# Altium schematic sheet Battery_power.SchDoc
size A; SheetNumber: 3; SheetTotal: 4
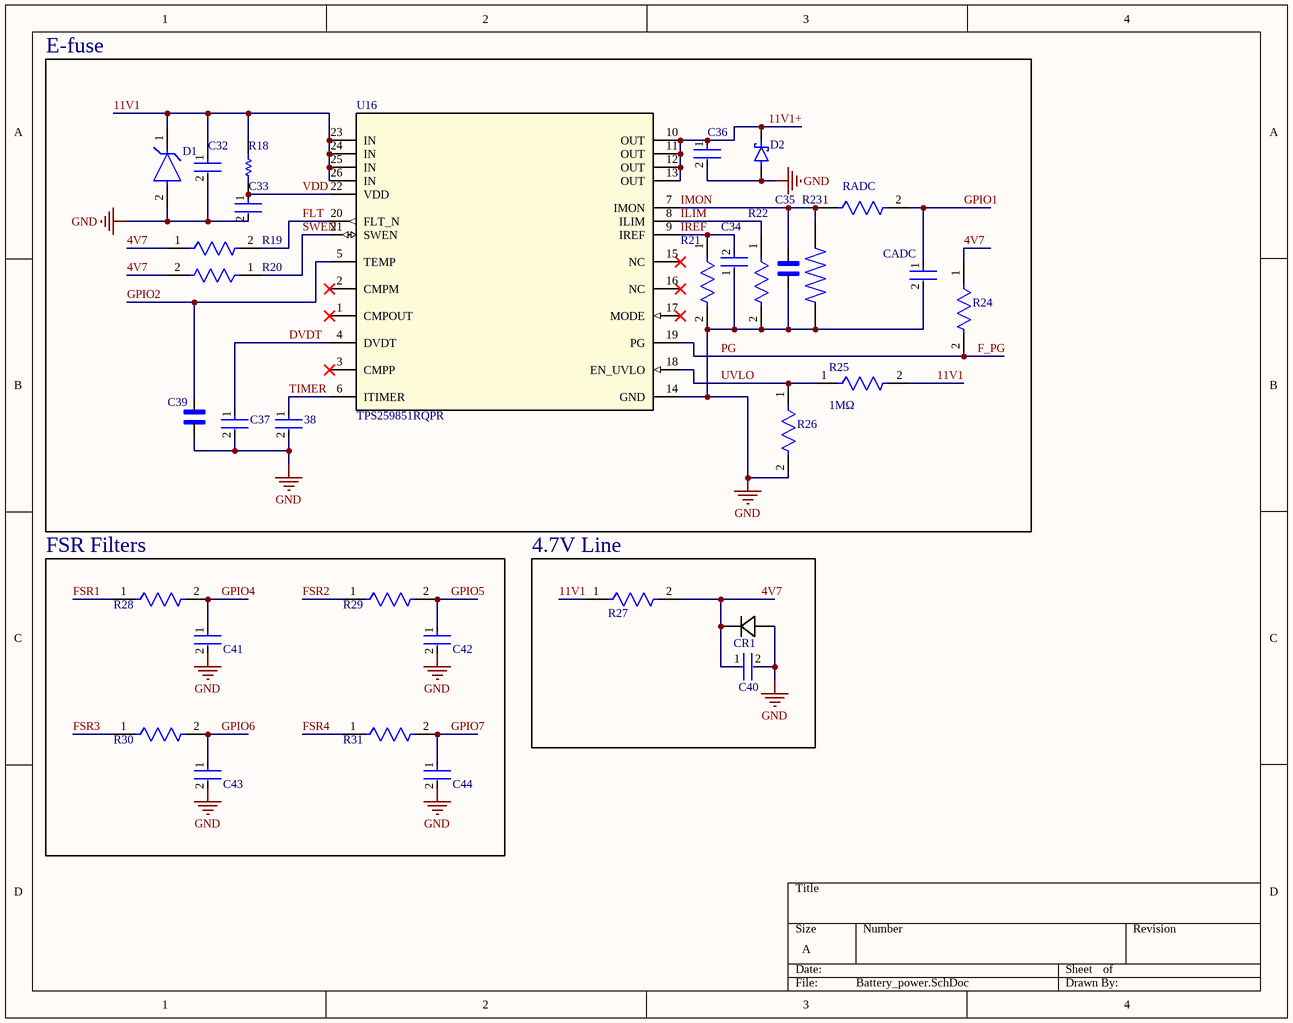
[diagram p0: Battery_power.SchDoc]

## Parts
38  GRM155R71H104KE14D  [FP-GRM155-0_05-IPC_B]  (value not drawn)
C32  CC0805KRX7R9BB104  [FP-CC0805-0_85-MFG]  (value not drawn)
C33  CC0805KKX7R9BB225  [FP-CC0805-0_85-MFG]  (value not drawn)
C34  C1608C0G1E472J080AA  [FP-C1608-080-0_1-IPC_A]  (value not drawn)
C35  GRM1885C1H101JA01D  [CAPC1608X90N]  (value not drawn)
C36  CC0805KKX7R9BB225  [FP-CC0805-0_85-MFG]  (value not drawn)
C37  GRM155R71H104KE14D  [FP-GRM155-0_05-IPC_B]  (value not drawn)
C39  GRM1885C1H101JA01D  [CAPC1608X90N]  (value not drawn)
C40  GRM155R71H104KE14D  [FP-GRM155-0_05-IPC_B]  (value not drawn)
C41  GRM155R71H104KE14D  [FP-GRM155-0_05-IPC_B]  (value not drawn)
C42  GRM155R71H104KE14D  [FP-GRM155-0_05-IPC_B]  (value not drawn)
C43  GRM155R71H104KE14D  [FP-GRM155-0_05-IPC_B]  (value not drawn)
C44  GRM155R71H104KE14D  [FP-GRM155-0_05-IPC_B]  (value not drawn)
CADC  CGA4C2C0G1H822J060AA  [FP-CGA4J-IPC_A]  (value not drawn)
CR1  BZT52C4V7-7-F  [SOD123_DIO]  (value not drawn)
D1  SMBJ12A  [FP-SMBJ-MFG]  (value not drawn)
D2  PDS1040-13  [DIO_PDS1040-13]  (value not drawn)
R18  CRCW040210R0FKED  [RESC1005X40X25NL05T05]  (value not drawn)
R19  CRCW040210K0FKEDC  [FP-CRCW0402-C-e3-IPC_C]  (value not drawn)
R20  CRCW0402100KFKED  [FP-CRCW0402-e3-IPC_C]  (value not drawn)
R21  RT0402BRD0748K7L  [FP-RT0402-MFG]  (value not drawn)
R22  RC0402FR-07499RL  [FP-RC0402-0_4-IPC_A]  (value not drawn)
R23  ERA3AEB102V  [RES_ERA3AEB102V]  (value not drawn)
R24  CRCW040210K0FKEDC  [FP-CRCW0402-C-e3-IPC_C]  (value not drawn)
R25  CRCW04021M00FKED  [CRCW0402-e3_MFG]  (value not drawn)
R26  CRCW0402121KFKED  [FP-CRCW0402-e3-MFG]  (value not drawn)
R27  RC0603FR-0710KL  [FP-RC0603-0_55-IPC_C]  (value not drawn)
R28  CRCW08054K70FKEA  [FP-CRCW0805-e3-IPC_B]  (value not drawn)
R29  CRCW08054K70FKEA  [FP-CRCW0805-e3-IPC_B]  (value not drawn)
R30  CRCW08054K70FKEA  [FP-CRCW0805-e3-IPC_B]  (value not drawn)
R31  CRCW08054K70FKEA  [FP-CRCW0805-e3-IPC_B]  (value not drawn)
RADC  CRCW08054K70FKEA  [FP-CRCW0805-e3-IPC_B]  (value not drawn)
U16  TPS259851RQPR  [RQP0026A-MFG]

## Blocks framed on the sheet
E-fuse: 38 C32-C37 C39 CADC D1 D2 R18-R26 RADC U16
FSR Filters: C41-C44 R28-R31
4.7V Line: C40 CR1 R27

## Nets
GND: 38.2 C32.2 C33.2 C34.1 C35.1 C36.2 C37.2 C39.1 C40.2 C41.2 C42.2 C43.2 C44.2 CADC.2 CR1.2 D1.2(A) D2.1(A) D2.2(A__1) R21.2 R22.2 R23.1 R26.2 U16.14(GND)
4V7: C40.1 CR1.1 R19.1 R20.2 R24.1 R27.2
11V1: C32.1 D1.1(C) R18.1 R25.2 R27.1 U16.23(IN) U16.24(IN) U16.25(IN) U16.26(IN)
11V1+: C36.1 D2.3(K) U16.10(OUT) U16.11(OUT) U16.12(OUT) U16.13(OUT)
DVDT: C37.1 U16.4(DVDT)
F_PG: R24.2 U16.19(PG)  [also labelled PG]
FLT: R19.2 U16.20(FLT_N)
FSR1: R28.1
FSR2: R29.1
FSR3: R30.1
FSR4: R31.1
GPIO1: CADC.1 RADC.2
GPIO2: C39.2 U16.5(TEMP)
GPIO4: C41.1 R28.2
GPIO5: C42.1 R29.2
GPIO6: C43.1 R30.2
GPIO7: C44.1 R31.2
ILIM: R22.1 U16.8(ILIM)
IMON: C35.2 R23.2 RADC.1 U16.7(IMON)
IREF: C34.2 R21.1 U16.9(IREF)
SWEN: R20.1 U16.21(SWEN)
TIMER: 38.1 U16.6(ITIMER)
UVLO: R25.1 R26.1 U16.18(EN_UVLO)
VDD: C33.1 R18.2 U16.22(VDD)

Not connected (* = marked no-connect by the designer): U16 1(CMPOUT)* 2(CMPM)* 3(CMPP)* 15(NC)* 16(NC)* 17(MODE)*

## Library data of the parts
38 C37 C40-C44 = CMP-2008-04639-2: Chip Multilayer Ceramic Capacitors for General Purpose, 0402, 0.10uF, X7R, 15%, 10%, 50V; Dissipation Factor: 0.025%; Capacitance: 100nF; Weight: 0.000212oz; Thickness: 0.022inch; Voltage Rating (DC): 50V; Dielectric Material: Ceramic; Termination: SMD/SMT; Case/Package: 0402; Case Code (Imperial): 0402; Mount: Surface Mount; REACH SVHC: No SVHC; Resistor Type: Ceramic; Dielectric: X7R; Max Operating Temperature: 125°C; Voltage: 50V; Lead Free: Lead Free; Package Quantity: 10000; Packaging: Tape and Reel; Length: 1mm; Material: Ceramic; Height: 0.5mm; Depth: 0.5mm; Width: 0.5mm; Min Operating Temperature: -55°C; Tolerance: 10%; Case Code (Metric): 1005; Voltage Rating: 50V
C32 = CMP-2100-03606-3: CAP CER 0.1UF 50V X7R 0805; Manufacturer: Yageo; Tolerance: 0.1; Capacitance: 100 nF; Value: 100 nF; Material: Ceramic; Device Class L1: Passive Components; ComponentLink2Description: Datasheet; Package: CC0805-0.85; Manufacturer Part Number: CC0805KRX7R9BB104; Digikey Description: CAP CER 0.1UF 50V X7R 0805; Device Class L3: Ceramic Capacitors; Temperature: -30°C to +85°C; Temperature Characteristic: X7R; Voltage Rating: 50 V; Height: 0.95mm; RoHS: TRUE; Ipc Land Pattern Name: CAPC200125X85; Device Class L2: Capacitors; Category: Cap; Temperature Range Low: -30°C; Temperature Range High: +85°C; Mouser Description: Multilayer Ceramic Capacitors MLCC - SMD/SMT 100nF 50V X7R 10%; Footprint Url: http://www.yageo.com/exep/pages/download/literatures/UPY-C_GEN_24.pdf; Automotive: No; Octopart: https://octopart.com/cc0805krx7r9bb104-yageo-192993; Lead Free: Yes; ComponentLink2URL: http://www.yageo.com/documents/recent/UPY-GPHC_Y5V_6.3V-to-50V_8.pdf
C33 C36 = CMP-03422-001390-1: CAP CER 2.2UF 50V X7R 0805; Manufacturer: Yageo; Tolerance: 0.1; Material: Ceramic; ComponentLink2Description: Datasheet; ComponentLink2URL: http://www.yageo.com/documents/recent/UPY-GPHC_Y5V_6.3V-to-50V_8.pdf; Voltage Rating: 50 V; Device Class L2: Capacitors; Footprint Url: http://www.yageo.com/exep/pages/download/literatures/UPY-C_GEN_24.pdf; Device Class L3: Ceramic Capacitors; Temperature Range High: +85°C; Category: Cap; Lead Free: Yes; Height: 0.95mm; Automotive: No; Value: 2.2 uF; Temperature Range Low: -30°C; Octopart: https://octopart.com/cc0805kkx7r9bb225-yageo-51849248; Temperature Characteristic: X7R; Ipc Land Pattern Name: CAPC200125X85; Mouser Description: 0805 50 V 2.2 uF ±10% Tolerance X7R Multilayer Ceramic Capacitor; RoHS: TRUE; Temperature: -30°C to +85°C; Capacitance: 2.2 uF; Package: CC0805-0.85; Digikey Description: CAP CER 2.2UF 50V X7R 0805; Manufacturer Part Number: CC0805KKX7R9BB225; Device Class L1: Passive Components
C34 = CMP-08246-004785-1: Multilayer Ceramic Capacitors 4.7nF ±5% 25V C0G SMD 0603; Dielectric Material: Ceramic; RoHS Compliant: Yes; Tolerance: 5%; Thickness: 0.037inch; Voltage Rating: 25V; Number of Pins: 2; Series: C; Max Operating Temperature: 125°C; Lead Free: Lead Free; Case Code (Metric): 1608; Construction: Flat; Case/Package: 0603; Min Operating Temperature: -55°C; Mount: Surface Mount; Voltage Rating (DC): 25V; Depth: 0.8mm; Case Code (Imperial): 0603; Width: 0.031inch; Radiation Hardening: No; Package Quantity: 1; Weight: 7.1E-05oz; Length: 1.6mm; Packaging: Tape and Reel; Height: 0.8mm; Dielectric: C0G; Capacitance: 4.7nF; Termination: SMD/SMT
C35 C39 = CMP-001-00083-1: SMD Capacitor C0G(EIA) with Capacitance: 100pF Tol. 5%. Rated Voltage: 50Vdc; MF: Murata Electronics; Source: GRM1885C1H101JA01D.SchLib; MP: GRM1885C1H101JA01D; Value: 100pF; Component Type: Standard; Pins: 2; Case/Package: 1608 Murata; Design Item ID: GRM1885C1H101JA01D; SnapEDA_Link: https://www.snapeda.com/parts/GRM1885C1H101JA01D/Murata+Electronics+North+America/view-part/?ref=snap; Check_prices: https://www.snapeda.com/parts/GRM1885C1H101JA01D/Murata+Electronics+North+America/view-part/?ref=eda
CADC = CMP-08246-000542-1: Cap Ceramic 8.2nF 50V C0G 5% Pad SMD 0805 +125°C Automotive T/R; Capacitance: 8.2nF; Case/Package: 0805; Package Quantity: 1; Weight: 0.000194oz; Voltage Rating (DC): 50V; Composition: Ceramic; Min Operating Temperature: -55°C; Case Code (Metric): 2012; Length: 2mm; Packaging: Tape and Reel; Height: 0.6mm; REACH SVHC: No SVHC; Case Code (Imperial): 0805; Mount: Surface Mount; Voltage Rating: 50V; Dielectric: C0G; Max Operating Temperature: 125°C; Width: 0.049inch; Depth: 1.25mm; Tolerance: 5%; Termination: SMD/SMT; Thickness: 0.028inch; Ratings: AEC-Q200
CR1 = BZT52C4V7-7-F: No Description Available; Manufacturer_Name: Diodes Inc; Copyright: Copyright (C) 2026 Ultra Librarian. All rights reserved.; Manufacturer_Part_Number: BZT52C4V7-7-F
D1 = CMP-2000-07093-2: TVS DIODE 12V 19.9V DO214AA; Manufacturer: Littelfuse; Breakdown Voltage: 13.3V; Peak Pulse Current: 30.2A; Max Junction Temp: +150°C; Peak Pulse Power: 600W; Direction: Unidirectional; Number Of Channels: 1; Lead Free: Yes; Reverse Standoff Voltage: 12V; ComponentLink2URL: https://www.littelfuse.com/~/media/electronics/datasheets/tvs_diodes/littelfuse_tvs_diode_smbj_datasheet.pdf.pdf; RoHS: TRUE; Clamping Voltage: 19.9V; Octopart: https://octopart.com/smbj12a-littelfuse-28708; Automotive: No; Manufacturer Part Number: SMBJ12A; Package: SMBJ; Mouser Description: Diode; 30.2 A (Max.); 13.30 V (Min.) @ 1 mA; 5 uA (Max.) @ 12 V; 100 A (Max.); Temperature Range High: +150°C; Device Class L1: Circuit Protection; Category: Diode; Height: 2.61mm; ComponentLink2Description: Datasheet; Digikey Description: TVS DIODE 12V 19.9V DO214AA; Device Class L3: unset; Temperature Range Low: -65°C; Temperature: -65°C to +150°C; Device Class L2: TVS Diodes
D2 = CMP-004-00032-1: Diode Schottky 40V 10A 3Pin PowerDI 5; MF: Diodes Inc.; Design Item ID: PDS1040-13; Case/Package: PowerDIâ„¢-5 Diodes Inc.; Pins: 3; Component Type: Standard; MP: PDS1040-13; Check_prices: https://www.snapeda.com/parts/PDS1040-13/Diodes+Inc./view-part/?ref=eda; Value: *; SnapEDA_Link: https://www.snapeda.com/parts/PDS1040-13/Diodes+Inc./view-part/?ref=snap; Source: PDS1040-13.SchLib
R18 = CMP-2002-08143-1: Manufacturer: Vishay Dale; Part Number: CRCW040210R0FKED
R19 R24 = CMP-02407-012085-1: RES 10K OHM 1% 1/16W 0402; Temperature Coefficient: 100ppm/°C; Power Rating: 62.5mW; Resistance: 10kR; Lead Free: Lead Free; Max Operating Temperature: 155°C; RoHS Compliant: Yes; Mount: Surface Mount; Min Operating Temperature: -55°C; Termination: Wraparound; Length: 1mm; Resistor Type: Thick Film; Contact Plating: Tin; Tolerance: 1%; Case/Package: Molded
R20 = CMP-2002-08123-3: RES Thick Film, 100kΩ, 1%, 0.063W, 100ppm/°C, 0402; Power Rating: 63mW; Resistance: 100kR; Voltage Rating (DC): 50V; Lead Free: Lead Free; Height: 0.35mm; Contact Plating: Tin; Min Operating Temperature: -55°C; Package Quantity: 10000; Case/Package: 0402; Temperature Coefficient: 100ppm/°C; Number of Terminations: 2; Packaging: Tape and Reel; Max Power Dissipation: 63mW; Case Code (Metric): 1005; Mount: Surface Mount; Width: 0.02inch; Termination: SMD/SMT; Length: 1mm; Number of Pins: 2; Weight: 2.3E-05oz; Radiation Hardening: No; Tolerance: 1%; Military Standard: Not; Features: Automotive AEC-Q200; Depth: 0.5mm; Composition: Thick Film; Max Operating Temperature: 155°C; Voltage Rating: 50V; Case Code (Imperial): 0402
R21 = CMP-2002-02883-2: RES SMD 48.7K OHM 0.1% 1/16W; Manufacturer: Yageo; Value: 48.7KΩ; Power Rating: 0.063W; Voltage Rating: 50V; Tolerance: 0.001; Temperature Coefficient: 25 ppm/°C; Package: RT0402; Temperature Range Low: -55°C; ComponentLink2Description: Datasheet; Composition: Thin Film; Footprint Url: http://www.yageo.com/exep/pages/download/literatures/PYu-R_Mount_10.pdf; Temperature: -55°C to +155°C; Octopart: https://octopart.com/rt0402brd0748k7l-yageo-1374792; Device Class L3: Chip SMD Resistors; Manufacturer Part Number: RT0402BRD0748K7L; Automotive: No; Height: 0.35mm; Category: Res; Resistance: 48.7KΩ; Lead Free: Yes; Mouser Description: Thin Film Resistors - SMD 1/16W 48.7K ohm .1% 25ppm; Device Class L2: Resistors; Series: RT; ComponentLink2URL: http://www.yageo.com/documents/recent/PYu-RT_1-to-0.01_RoHS_L_9.pdf; Ipc Land Pattern Name: RESC10050X30; RoHS: TRUE; Device Class L1: Passive Components; Digikey Description: RES SMD 48.7K OHM 0.1% 1/16W; Temperature Range High: +155°C
R22 = CMP-2002-07708-2: RES 499 OHM 1% 1/16W 0402; Power Rating: 62.5mW; Voltage Rating: 50V; Max Power Dissipation: 63mW; Temperature Coefficient: 100ppm/°C; Resistance: 499R; Width: 0.02inch; Resistance Tolerance: 1%; Package Quantity: 1; Military Standard: Not; Resistor Type: Thick Film; Height: 0.016inch; Features: Moisture Resistant; Lead Free: Lead Free; Case Code (Metric): 1005; Series: RC; REACH SVHC: No SVHC; Packaging: Tape and Reel; Depth: 0.5mm; Size Code: 0402; Min Operating Temperature: -55°C; Voltage Rating (DC): 50V; Max Operating Temperature: 155°C; Termination: SMD/SMT; Length: 0.039inch; RoHS Compliant: Yes; Case Code (Imperial): 0402; Construction: Rectangular; Number of Terminations: 2; Tolerance: 1%; Case/Package: 0402
R23 = CMP-009-00180-1: Resistor, SMD 1 kOhm 0603 0.1 %; MP: ERA-3AEB102V; Value: 1k; MF: Panasonic; Digi-Key_Part_Number: P1.0KDBCT-ND; Check_prices: https://www.snapeda.com/parts/ERA-3AEB102V/Panasonic%20Electronic%20Components/view-part/260476/?ref=eda; Case/Package: 1608-2 Panasonic; Design Item ID: ERA3AEB102V; Component Type: Standard; Pins: 2; SnapEDA_Link: https://www.snapeda.com/parts/ERA-3AEB102V/Panasonic%20Electronic%20Components/view-part/260476/?ref=snap; Source: ERA3AEB102V.SchLib
R25 = CMP-2002-08314-3: 63mW Thick Film Resistors 75V ±1% ±100ppm/℃ 1MΩ 0402 Chip Resistor - Surface Mount ROHS; Voltage Rating: 50V; Temperature Coefficient: 100ppm/°C; Ratings: AEC-Q200; Width: 500µm; Contact Plating: Tin; Max Power Dissipation: 63mW; Max Operating Temperature: 155°C; Lifecycle Status: Production; ComponentLink2URL: http://www.vishay.com/docs/20035/dcrcwe3.pdf; Power Rating: 63mW; Height: 350µm; Termination: SMD/SMT; Min Operating Temperature: -55°C; Lead Free: Lead Free; Packaging: Cut Tape; Depth: 500µm; Tolerance: 1%; Mount: Surface Mount; Number of Pins: 2; Number of Terminals: 2; ComponentLink1Description: Manufacturer's Website; Working Voltage: 50V; China RoHS: Non-Compliant; Schedule B: 8533210045, 8533210045; HelpURL: http://www.vishay.com/docs/20035/dcrcwe3.pdf; RoHS: Compliant; ComponentLink2Description: Datasheet URL; Number of Terminations: 2; Case Code (Imperial): 0402; Weight: 652.039032µg; Military Standard: Not; Resistance: 1MΩ; Voltage Rating (DC): 50V; Case/Package: 0402; ComponentLink1URL: http://www.vishay.com; Radiation Hardening: No; Features: Automotive AEC-Q200; Composition: Thick Film; Length: 1mm; REACH SVHC: Yes
R26 = CMP-2002-08171-2: RES Thick Film, 121kΩ, 1%, 0.063W, 100ppm/°C, 0402; Voltage Rating (DC): 50V; Max Power Dissipation: 63mW; Resistance: 121kR; Military Standard: Not; Weight: 2.3E-05oz; Termination: SMD/SMT; Case Code (Metric): 1005; Width: 0.5mm; Tolerance: 1%; Contact Plating: Tin; Temperature Coefficient: 100ppm/°C; Depth: 0.5mm; Length: 1mm; Package Quantity: 10; Radiation Hardening: No; Packaging: Tape and Reel; Power Rating: 63mW; Features: Automotive AEC-Q200; Lead Free: Lead Free; Composition: Thick Film; Min Operating Temperature: -55°C; Height: 0.35mm; Voltage Rating: 50V; Case/Package: 0402; Number of Terminations: 2; Max Operating Temperature: 155°C; Case Code (Imperial): 0402
R27 = CMP-2100-03664-2: RES 10K OHM 1% 1/10W 0603; Voltage Rating: 75V; Voltage Rating (DC): 50V; Resistance: 10kR; Power Rating: 100mW; Temperature Coefficient: 100ppm/°C; Depth: 0.8mm; Termination: SMD/SMT; Resistor Type: Thick Film; Series: RC; Construction: Rectangular; Features: Moisture Resistant; Packaging: Tape and Reel; Min Operating Temperature: -55°C; Number of Terminations: 2; Lead Pitch: 0.3mm; RoHS Compliant: Yes; Case/Package: 0603; Resistance Tolerance: 1%; Military Standard: Not; Weight: 7.1E-05oz; Number of Pins: 2; Tolerance: 1%; Length: 1.6mm; Case Code (Imperial): 0603; Lead Free: Lead Free; Width: 0.8mm; Max Power Dissipation: 100mW; Height: 0.45mm; Max Operating Temperature: 155°C; Case Code (Metric): 1608; Size Code: 0603
R28-R31 RADC = CMP-2100-03615-2: RES Thick Film, 4.7kΩ, 1%, 0.125W, 100ppm/°C, 0805; Max Power Dissipation: 125mW; Resistance: 4.7kR; Voltage Rating: 150V; Termination: SMD/SMT; Weight: 0.000194oz; Case/Package: 0805; Number of Terminations: 2; Min Operating Temperature: -55°C; Case Code (Metric): 2012; Package Quantity: 10; Depth: 1.25mm; Military Standard: Not; Composition: Thick Film; Radiation Hardening: No; Contact Plating: Tin; Height: 0.45mm; Power Rating: 125mW; Features: Automotive AEC-Q200; Tolerance: 1%; Packaging: Tape and Reel; Max Operating Temperature: 155°C; Length: 2mm; Case Code (Imperial): 0805; Voltage Rating (DC): 150V; Width: 1.25mm; Temperature Coefficient: 100ppm/°C; Lead Free: Lead Free
U16 = CMP-027-000000-2: 4.5-V to 16-V, 0.59-mÎ©, 80-A stackable compact eFuse with accurate and fast current monitor 26-VQFN-HR -40 to 125; Manufacturer_Name: Texas Instruments; Manufacturer_Part_Number: TPS259851RQPR; Source: TPS259851RQPR.SchLib; TYPE: TYPE; Design Item ID: TPS259851RQPR; Copyright: Copyright (C) 2025 Ultra Librarian. All rights reserved.; RefDes: RefDes